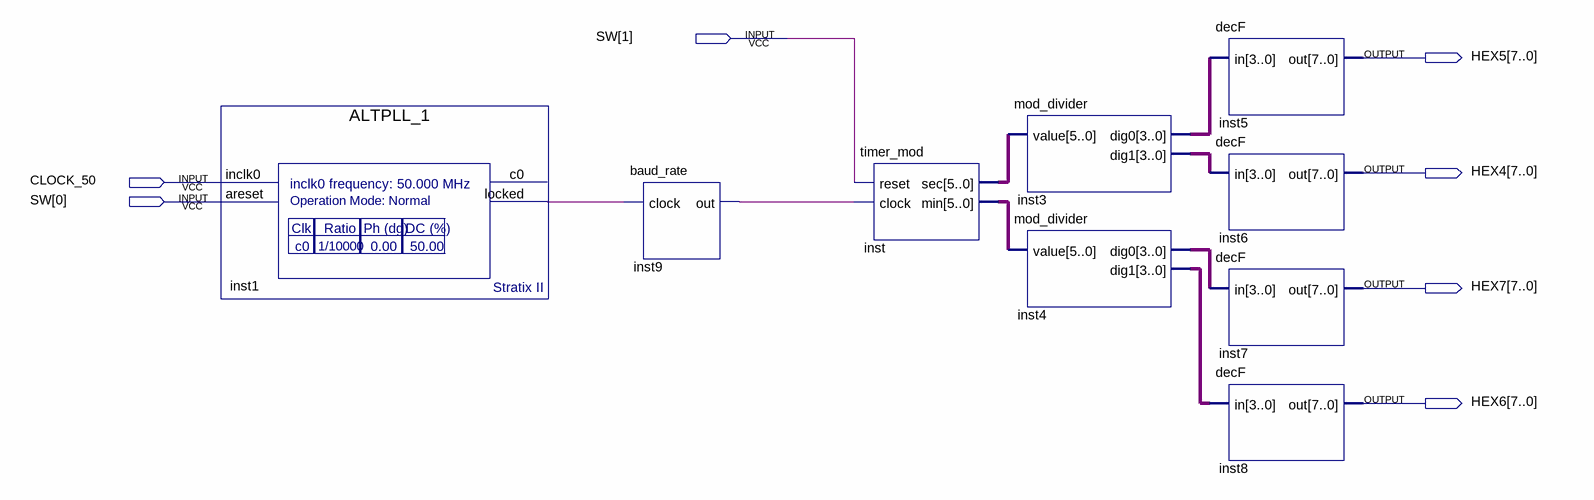
[diagram p0: schematic sheet]
// Quartus schematic timer.bdf as structural Verilog: 9 symbols, 7 pins
module timer (
  input  [1:0] SW,
  input  CLOCK_50,
  output [7:0] HEX5,
  output [7:0] HEX4,
  output [7:0] HEX7,
  output [7:0] HEX6
);

  wire inst1_locked, inst9_out;
  wire [3:0] inst3_dig0, inst3_dig1, inst4_dig0, inst4_dig1;
  wire [5:0] inst_min, inst_sec;

  ALTPLL_1 inst1 (.inclk0(CLOCK_50), .areset(SW[0]), .locked(inst1_locked));  // open: c0
  baud_rate inst9 (.clock(inst1_locked), .out(inst9_out));
  timer_mod inst (.reset(SW[1]), .clock(inst9_out), .sec(inst_sec), .min(inst_min));
  mod_divider inst3 (.value(inst_sec), .dig0(inst3_dig0), .dig1(inst3_dig1));
  mod_divider inst4 (.value(inst_min), .dig0(inst4_dig0), .dig1(inst4_dig1));
  decF inst5 (.in(inst3_dig0), .out(HEX5));
  decF inst6 (.in(inst3_dig1), .out(HEX4));
  decF inst7 (.in(inst4_dig0), .out(HEX7));
  decF inst8 (.in(inst4_dig1), .out(HEX6));
endmodule
